# Altium schematic sheet Board-A_Schematics.SchDoc
size A3; SheetNumber: 1; SheetTotal: 1
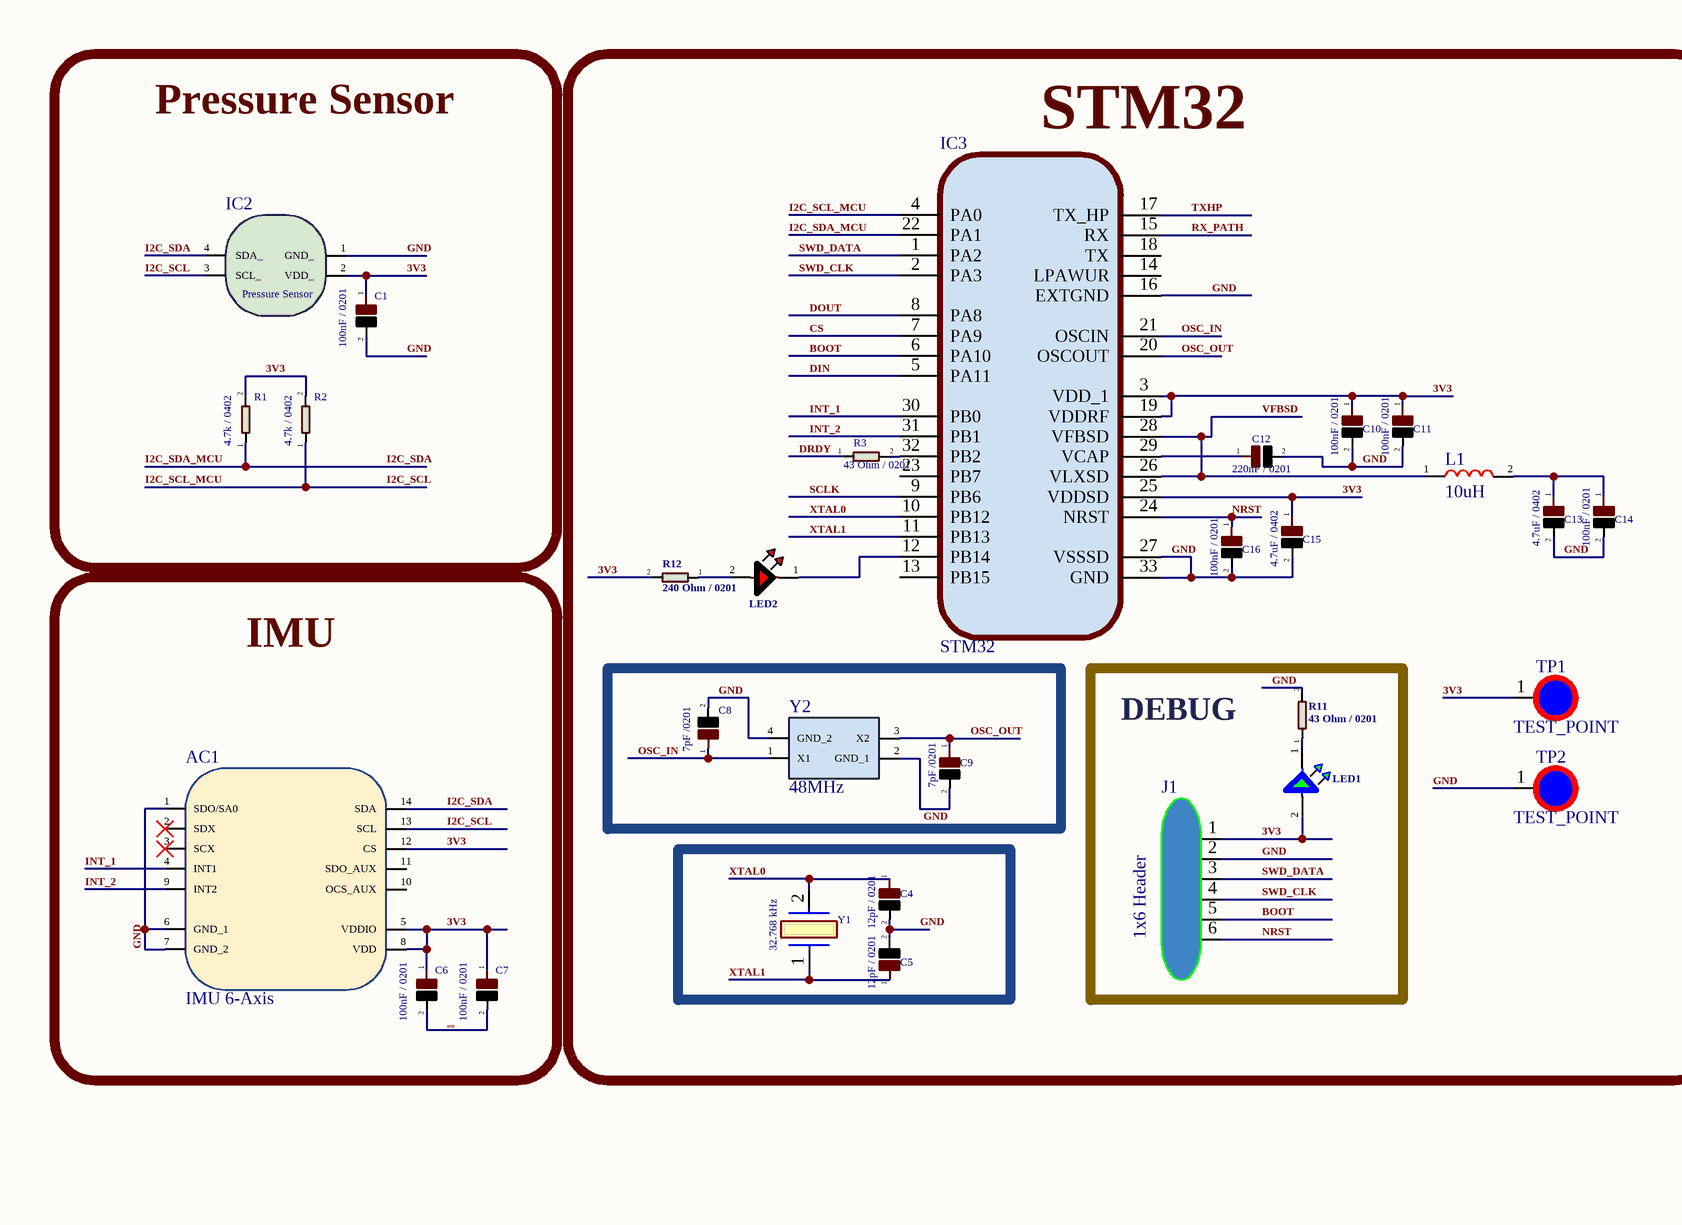
[diagram p0: Board-A_Schematics.SchDoc, left]
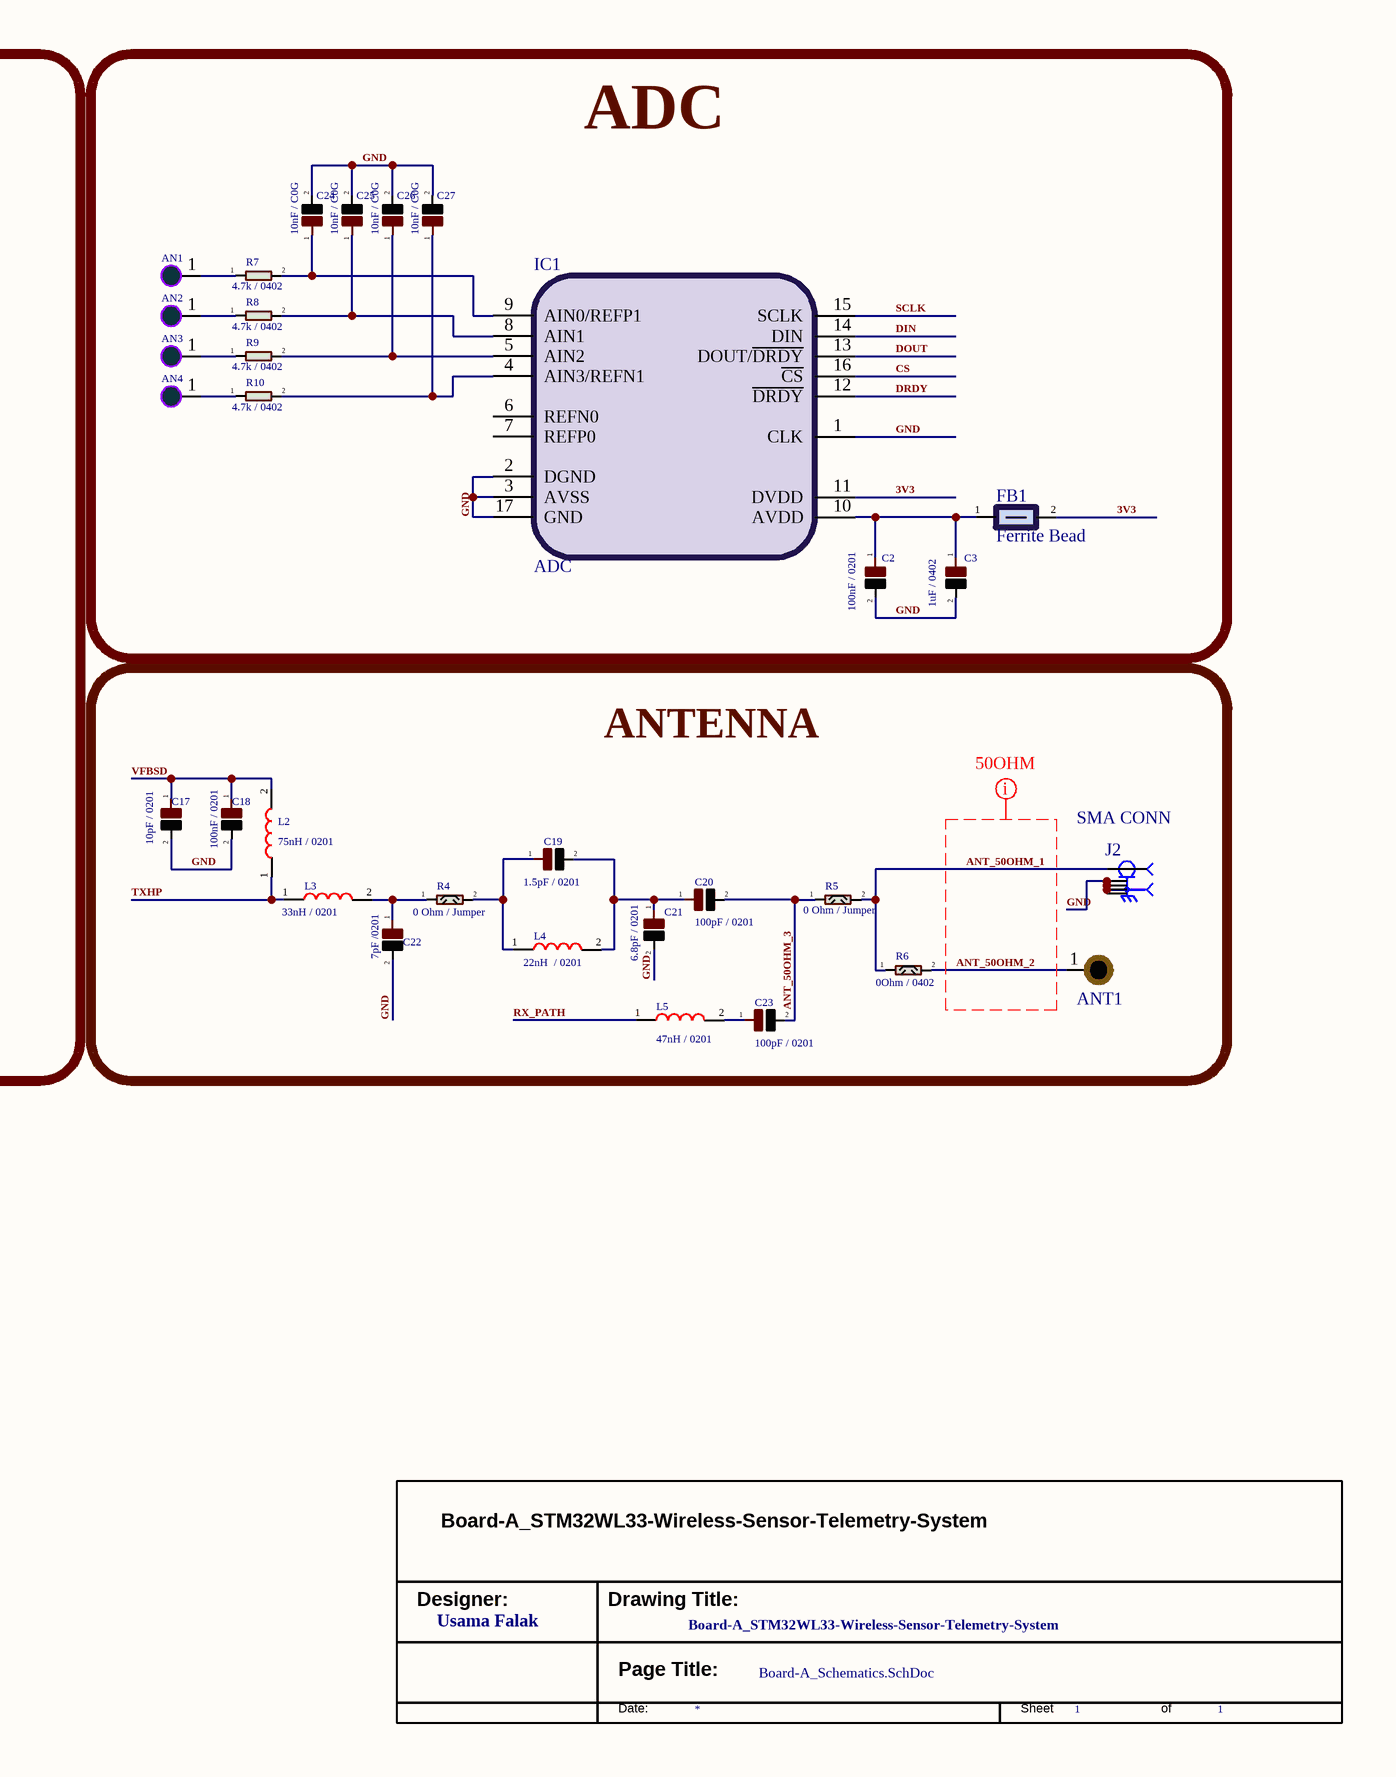
[diagram p1: Board-A_Schematics.SchDoc, right]

## Parts
*  TitleBlock_MCPG_a  (value not drawn)  (graphical)
AC1  IMU 6-Axis  [LSM6DS3USTR]
AN1  ADC_AIN  [Analogue Pad]  (value not drawn)
AN2  ADC_AIN  [Analogue Pad]  (value not drawn)
AN3  ADC_AIN  [Analogue Pad]  (value not drawn)
AN4  ADC_AIN  [Analogue Pad]  (value not drawn)
ANT1  PAD  [ANTENNA-PAD]  (value not drawn)
C1  100nF / 0201  [CAPC-C0201]
C2  100nF / 0201  [CAPC-C0201]
C3  1uF / 0402  [CAPC-C0402]
C4  12pF / 0201  [CAPC-C0201]
C5  12pF / 0201  [CAPC-C0201]
C6  100nF / 0201  [CAPC-C0201]
C7  100nF / 0201  [CAPC-C0201]
C8  7pF /0201  [CAPC-C0201]
C9  7pF /0201  [CAPC-C0201]
C10  100nF / 0201  [CAPC-C0201]
C11  100nF / 0201  [CAPC-C0201]
C12  220nF / 0201  [CAPC-C0201]
C13  4.7uF / 0402  [CAPC-C0402]
C14  100nF / 0201  [CAPC-C0201]
C15  4.7uF / 0402  [CAPC-C0402]
C16  100nF / 0201  [CAPC-C0201]
C17  10pF / 0201  [CAPC-C0201]
C18  100nF / 0201  [CAPC-C0201]
C19  1.5pF / 0201  [CAPC-C0201]
C20  100pF / 0201  [CAPC-C0201]
C21  6.8pF / 0201  [CAPC-C0201]
C22  7pF /0201  [CAPC-C0201]
C23  100pF / 0201  [CAPC-C0201]
C24  10nF / C0G  [CAPC-C0402]
C25  10nF / C0G  [CAPC-C0402]
C26  10nF / C0G  [CAPC-C0402]
C27  10nF / C0G  [CAPC-C0402]
FB1  Ferrite Bead  [BLM15PX_BH1]
IC1  ADC  [QFN50P350X350X100-17N-D]
IC2  Pressure Sensor  [MS584002BA01]
IC3  STM32  [QFN50P500X500X100-33N-D]
J1  1x6 Header  [GRPB032MWCNRC]
J2  SMA CONN  [SAMTEC_SMA-J-P-H-ST-EM1]
L1  10uH  [IND-C1608X95N]
L2  75nH / 0201  [INDC-C0201]
L3  33nH / 0201  [INDC-C0201]
L4  22nH  / 0201  [INDC-C0201]
L5  47nH / 0201  [IND-0201]
LED1  GREEN-LED  [LEDC-C0201]  (value not drawn)
LED2  RED-LED  [LEDC-C0201]  (value not drawn)
R1  4.7k / 0402  [RESC-C0402]
R2  4.7k / 0402  [RESC-C0402]
R3  43 Ohm / 0201  [RESC-C0201]
R4  0 Ohm / Jumper  [RESC-C0201]
R5  0 Ohm / Jumper  [RESC-C0201]
R6  0Ohm / 0402  [RESC-C0402]
R7  4.7k / 0402  [RESC-C0402]
R8  4.7k / 0402  [RESC-C0402]
R9  4.7k / 0402  [RESC-C0402]
R10  4.7k / 0402  [RESC-C0402]
R11  43 Ohm / 0201  [RESC-C0201]
R12  240 Ohm / 0201  [RESC-C0201]
TP1  TEST_POINT  [TEST-POINT]
TP2  TEST_POINT  [TEST-POINT]
Y1  32.768 kHz  [Q13FC1350000400]
Y2  48MHz  [ABM11W300000MHZ4B1UT3]

## Blocks framed on the sheet
Pressure Sensor: C1 IC2 R1 R2
STM32: C4 C5 C8-C16 IC3 L1 LED2 R3 R12 TP1 TP2 Y1 Y2
ADC: AN1-AN4 C2 C3 C24-C27 FB1 IC1 R7-R10
IMU: AC1 C6 C7
DEBUG: J1 LED1 R11
ANTENNA: ANT1 C17-C23 J2 L2-L5 R4-R6

## Nets
3V3: AC1.5(VDDIO) AC1.8(VDD) AC1.12(CS) C1.1 C6.1 C7.1 C10.1 C11.1 C15.1 FB1.2 IC1.11(DVDD) IC2.2(VDD_) IC3.3(VDD_1) IC3.19(VDDRF) IC3.25(VDDSD) J1.1 LED1.2(A) R1.2 R2.2 R12.2 TP1.1
ANT_50OHM_1: J2.1 R5.2 R6.1
ANT_50OHM_2: ANT1.1 R6.2
ANT_50OHM_3: C20.2 C23.2 R5.1
BOOT: IC3.6(PA10) J1.5
CS: IC1.16(~{CS}) IC3.7(PA9)
DIN: IC1.14(DIN) IC3.5(PA11)
DOUT: IC1.13(DOUT/~{DRDY}) IC3.8(PA8)
DRDY: IC1.12(~{DRDY}) R3.1
GND: AC1.1(SDO/SA0) AC1.6(GND_1) AC1.7(GND_2) C1.2 C2.2 C3.2 C4.2 C5.2 C6.2 C7.2 C8.2 C9.2 C10.2 C11.2 C12.2 C13.2 C14.2 C15.2 C16.2 C17.2 C18.2 C21.2 C22.2 C24.2 C25.2 C26.2 C27.2 IC1.1(CLK) IC1.2(DGND) IC1.3(AVSS) IC1.17(GND) IC2.1(GND_) IC3.16(EXTGND) IC3.27(VSSSD) IC3.33(GND) J1.2 J2.2_1 J2.2_2 J2.3_1 J2.3_2 R11.2 TP2.1 Y2.2(GND_1) Y2.4(GND_2)
I2C_SCL: AC1.13(SCL) IC2.3(SCL_) IC3.4(PA0) R2.1  [also labelled I2C_SCL_MCU]
I2C_SDA: AC1.14(SDA) IC2.4(SDA_) IC3.22(PA1) R1.1  [also labelled I2C_SDA_MCU]
INT_1: AC1.4(INT1) IC3.30(PB0)
INT_2: AC1.9(INT2) IC3.31(PB1)
NRST: C16.1 IC3.24(NRST) J1.6
OSC_IN: C8.1 IC3.21(OSCIN) Y2.1(X1)
OSC_OUT: C9.1 IC3.20(OSCOUT) Y2.3(X2)
RX_PATH: IC3.15(RX) L5.1
SCLK: IC1.15(SCLK) IC3.9(PB6)
SWD_CLK: IC3.2(PA3) J1.4
SWD_DATA: IC3.1(PA2) J1.3
TXHP: IC3.17(TX_HP) L2.1 L3.1
VFBSD: C17.1 C18.1 IC3.26(VLXSD) IC3.28(VFBSD) L1.1 L2.2
XTAL0: C4.1 IC3.10(PB12) Y1.2(CRYSTAL_2)
XTAL1: C5.1 IC3.11(PB13) Y1.1
NetAN1_1: AN1.1 R7.1
NetAN2_1: AN2.1 R8.1
NetAN3_1: AN3.1 R9.1
NetAN4_1: AN4.1 R10.1
NetC2_1: C2.1 C3.1 FB1.1 IC1.10(AVDD)
NetC12_1: C12.1 IC3.29(VCAP)
NetC13_1: C13.1 C14.1 L1.2
NetC19_1: C19.1 L4.1 R4.2
NetC19_2: C19.2 C20.1 C21.1 L4.2
NetC22_1: C22.1 L3.2 R4.1
NetC23_1: C23.1 L5.2
NetC24_1: C24.1 IC1.9(AIN0/REFP1) R7.2
NetC25_1: C25.1 IC1.8(AIN1) R8.2
NetC26_1: C26.1 IC1.5(AIN2) R9.2
NetC27_1: C27.1 IC1.4(AIN3/REFN1) R10.2
NetIC3_12: IC3.12(PB14) LED2.1(K)
NetIC3_32: IC3.32(PB2) R3.2
NetLED1_1: LED1.1(K) R11.1
NetLED2_2: LED2.2(A) R12.1

Not connected (* = marked no-connect by the designer): AC1 2(SDX)* 3(SCX)* 10(OCS_AUX) 11(SDO_AUX); IC1 6(REFN0) 7(REFP0); IC3 13(PB15) 14(LPAWUR) 18(TX) 23(PB7)

## Layout directives
net class 50OHM: ANT_50OHM_1, ANT_50OHM_2

## Notes on the sheet
- (in symbol TitleBlock_MCPG_a) Board-A_STM32WL33-Wireless-Sensor-Telemetry-System; Designer:; Drawing Title:; Usama Falak; Page Title:; Date:; Sheet; of

## Library data of the parts
AC1 = LSM6DSOTR: Accelerometer, Gyroscope, 6 Axis Sensor I2C, SPI Output; Manufacturer_Name: STMicroelectronics; Datasheet Link: https://www.st.com/resource/en/datasheet/lsm6dso.pdf; Height: 0.86mm; Manufacturer_Part_Number: LSM6DSOTR; Mouser Part Number: 511-LSM6DSOTR; Mouser Price/Stock: https://www.mouser.co.uk/ProductDetail/STMicroelectronics/LSM6DSOTR?qs=lc2O%252BfHJPVbD197C5c7oNw%3D%3D; Arrow Part Number: LSM6DSOTR; Arrow Price/Stock: https://www.arrow.com/en/products/lsm6dsotr/stmicroelectronics.html?utm_currency=USD&region=europe
AN1-AN4 = ADC_PAD
ANT1 = ANTENNA-PAD
C1 C2 C6 C7 C10 C11 C14 C16 C18 = GRM033Z71C104KE14J: Multilayer Ceramic Capacitors MLCC - SMD/SMT 0.1 uF 16 VDC 10% 0201 X7R; Manufacturer_Name: Murata Electronics; Datasheet Link: https://search.murata.co.jp/Ceramy/image/img/A01X/G101/ENG/GRM033Z71C104KE14-01A.pdf; Height: 0.33mm; Manufacturer_Part_Number: GRM033Z71C104KE14J; Mouser Part Number: 81-GRM033Z71C104KE4J; Mouser Price/Stock: https://www.mouser.co.uk/ProductDetail/Murata-Electronics/GRM033Z71C104KE14J?qs=lEfY3O89AqkOnRdov738ag%3D%3D; LCSC-Part#: C5755505
C3 = TMK105AC6105KV-F: 1uF ±10% 25V Ceramic Capacitor X6S 0402; Manufacturer_Name: TAIYO YUDEN; Datasheet Link: https://componentsearchengine.com/Datasheets/2/TMK105AC6105KV-F.pdf; Height: 0.6mm; Manufacturer_Part_Number: TMK105AC6105KV-F; Mouser Part Number: 963-TMK105AC6105KV-F; Mouser Price/Stock: https://www.mouser.co.uk/ProductDetail/Taiyo-Yuden/TMK105AC6105KV-F?qs=VWNNG7jHlrK4QAsTUyZliw%3D%3D; LCSC-Part#: C2169575
C4 C5 = GJM0335C1E120GB01D: 12pF ±2% 25V Ceramic Capacitor X6S 0201; Manufacturer_Name: Murata Electronics; Datasheet Link: https://search.murata.co.jp/Ceramy/image/img/A01X/G101/ENG/GJM0335C1E120GB01-31A.pdf; Height: 0.33mm; Manufacturer_Part_Number: GJM0335C1E120GB01D; Mouser Part Number: 81-GJM0335C1E120GB1D; Mouser Price/Stock: https://www.mouser.co.uk/ProductDetail/Murata-Electronics/GJM0335C1E120GB01D?qs=ui%252B2d9lVEI54IbZGcLUeEQ%3D%3D; Arrow Part Number: GJM0335C1E120GB01D; Arrow Price/Stock: https://www.arrow.com/en/products/gjm0335c1e120gb01d/murata-manufacturing?region=nac; LCSC-Part#: C710720
C8 C9 C22 = GJM0335C1E7R0BB01D: 7pF 25V Ceramic Capacitor C0G 0201; Manufacturer_Name: Murata Electronics; Datasheet Link: https://search.murata.co.jp/Ceramy/image/img/A01X/G101/ENG/GJM0335C1E7R0BB01-31A.pdf; Height: 0.33mm; Manufacturer_Part_Number: GJM0335C1E7R0BB01D; LCSC-Part#: C1864565
C12 = GRM033C81A224KE01D: 220nF X6S ±10% 10V 0201 Ceramic Capacitors RoHS; Manufacturer_Name: Murata Electronics; Datasheet Link: https://search.murata.co.jp/Ceramy/image/img/A01X/G101/ENG/GRM033C81A224KE01-01A.pdf; Height: 0.33mm; Manufacturer_Part_Number: GRM033C81A224KE01D; LCSC-Part#: C20044506
C13 C15 = GRM155C61E475ME15J: 4.7uF ±20% 25V Ceramic Capacitor 0402; Manufacturer_Name: Murata Electronics; Datasheet Link: https://search.murata.co.jp/Ceramy/image/img/A01X/G101/ENG/GRM155C61E475ME15-01A.pdf; Height: 0.33mm; Manufacturer_Part_Number: GRM155C61E475ME15J; Mouser Part Number: 81-GRM15C61E475ME15J; Mouser Price/Stock: https://www.mouser.co.uk/ProductDetail/Murata-Electronics/GRM155C61E475ME15J?qs=By6Nw2ByBD02p8xq06vhEQ%3D%3D; Arrow Part Number: GRM155C61E475ME15J; Arrow Price/Stock: https://www.arrow.com/en/products/grm155c61e475me15j/murata-manufacturing?utm_currency=USD&region=nac; LCSC-Part#: C5846150
C17 = GJM0335C1E100GB01D: 10pF ±2% 25V Ceramic Capacitor C0G 0201; Manufacturer_Name: Murata Electronics; Datasheet Link: https://search.murata.co.jp/Ceramy/image/img/A01X/G101/ENG/GJM0335C1E100GB01-31A.pdf; Height: 0.33mm; Manufacturer_Part_Number: GJM0335C1E100GB01D; Mouser Part Number: 81-GJM0335C1E100GB1D; Mouser Price/Stock: https://www.mouser.co.uk/ProductDetail/Murata-Electronics/GJM0335C1E100GB01D?qs=ui%252B2d9lVEI7JJM6SC54Bmg%3D%3D; LCSC-Part#: C237422
C19 = GJM0335C1E1R5WB01D: 1.5pF 25V Ceramic Capacitor C0G 0201; Manufacturer_Name: Murata Electronics; Datasheet Link: https://search.murata.co.jp/Ceramy/image/img/A01X/G101/ENG/GJM0335C1E1R5WB01-01A.pdf; Height: 0.33mm; Manufacturer_Part_Number: GJM0335C1E1R5WB01D; Mouser Part Number: 81-GJM0335C1E1R5WB1D; Mouser Price/Stock: https://www.mouser.co.uk/ProductDetail/Murata-Electronics/GJM0335C1E1R5WB01D?qs=YLLXL5qGyDs1VzYPuYV7Xw%3D%3D; Arrow Part Number: GJM0335C1E1R5WB01D; Arrow Price/Stock: https://www.arrow.com/en/products/gjm0335c1e1r5wb01d/murata-manufacturing?utm_currency=USD&region=nac; LCSC-Part#: C435397
C20 C23 = GRM0335C1E101FA01D: Multilayer Ceramic Capacitors MLCC - SMD/SMT 100 pF 25 VDC 1% 0201 C0G (NP0); Manufacturer_Name: Murata Electronics; Datasheet Link: https://search.murata.co.jp/Ceramy/image/img/A01X/G101/ENG/GRM0335C1E101FA01-01A.pdf; Height: 0.33mm; Manufacturer_Part_Number: GRM0335C1E101FA01D; Mouser Part Number: 81-GRM0335C1E101FA1D; Mouser Price/Stock: https://www.mouser.co.uk/ProductDetail/Murata-Electronics/GRM0335C1E101FA01D?qs=3ZwS9AhGA%2F51pgyoCpOmmA%3D%3D; Arrow Part Number: GRM0335C1E101FA01D; Arrow Price/Stock: https://www.arrow.com/en/products/grm0335c1e101fa01d/murata-manufacturing; LCSC-Part#: C527989
C21 = GJM0335C1E6R8CB01D: Multilayer Ceramic Capacitors MLCC - SMD/SMT 6.8 pF 25 VDC 0.25 pF 0201 C0G (NP0); Manufacturer_Name: Murata Electronics; Datasheet Link: https://search.murata.co.jp/Ceramy/image/img/A01X/G101/ENG/GJM0335C1E6R8CB01-01A.pdf; Height: 0.33mm; Manufacturer_Part_Number: GJM0335C1E6R8CB01D; LCSC-Part#: C415404
C24-C27 = GRM1555C1E103GE01D: 10nF ±2% 25V Ceramic Capacitor C0G 0402; Manufacturer_Name: Murata Electronics; Datasheet Link: https://search.murata.co.jp/Ceramy/image/img/A01X/G101/ENG/GRM1555C1E103GE01-01A.pdf; Height: 0.33mm; Manufacturer_Part_Number: GRM1555C1E103GE01D; Mouser Part Number: 81-GRM1555C1E103GE1D; Mouser Price/Stock: https://www.mouser.co.uk/ProductDetail/Murata-Electronics/GRM1555C1E103GE01D?qs=d0WKAl%252BL4KYoPP5%252BcWf4LA%3D%3D; Arrow Part Number: GRM1555C1E103GE01D; Arrow Price/Stock: https://www.arrow.com/en/products/grm1555c1e103ge01d/murata-manufacturing?region=europe; LCSC-Part#: C3872300
FB1 = BLM15PX601SH1D: 600Ω@100MHz Ferrite Bead 0402 900mA 230mΩ; Manufacturer_Name: Murata Electronics; Datasheet Link: https://www.murata.com/en-global/products/productdetail.aspx?cate=luNoiseSupprFilteChipFerriBead&partno=BLM15PX601SH1%23; Manufacturer_Part_Number: BLM15PX601SH1D; Mouser Part Number: 81-BLM15PX601SH1D; Mouser Price/Stock: https://www.mouser.co.uk/ProductDetail/Murata-Electronics/BLM15PX601SH1D?qs=9vOqFld9vZUw2N2VCY80IQ%3D%3D; Arrow Part Number: BLM15PX601SH1D; Arrow Price/Stock: https://www.arrow.com/en/products/blm15px601sh1d/murata-manufacturing?utm_currency=USD&region=nac; LCSC-Part#: C7509833
IC1 = ADS1220IRVAR: 24 Bit Analog to Digital Converter 2, 4 Input 1 Sigma-Delta 16-VQFN (3.5x3.5); Manufacturer_Name: Texas Instruments; Datasheet Link: http://www.ti.com/lit/ds/symlink/ads1220.pdf; Height: 1mm; Manufacturer_Part_Number: ADS1220IRVAR; Mouser Part Number: 595-ADS1220IRVAR; Mouser Price/Stock: https://www.mouser.co.uk/ProductDetail/Texas-Instruments/ADS1220IRVAR?qs=5GI1giJCN%252BLdhhbryxXlqQ%3D%3D; Arrow Part Number: ADS1220IRVAR; Arrow Price/Stock: https://www.arrow.com/en/products/ads1220irvar/texas-instruments?utm_currency=USD&region=nac
IC2 = MS5840-02BA01: Pressure Sensor 4.35PSI ~ 17.4PSI (30kPa ~ 120kPa) Absolute 24 b 4-SMD, No Lead; Manufacturer_Name: TE Connectivity; Height: 1.7mm; Manufacturer_Part_Number: MS5840-02BA01; Mouser Part Number: 824-MS5840-02BA01; Mouser Price/Stock: https://www.mouser.co.uk/ProductDetail/Measurement-Specialties/MS5840-02BA01?qs=gZXFycFWdAN7%252BD1H1Y3uGA%3D%3D
IC3 = STM32WL33KBV7: ARM Microcontrollers - MCU Sub-GHz Wireless MCU Single-core Arm Cortex-M0+ 64 MHz 128 Kb Flash 32 Kb SRAM; Manufacturer_Name: STMicroelectronics; Datasheet Link: https://www.st.com/resource/en/datasheet/stm32wl33c8.pdf; Height: 1mm; Manufacturer_Part_Number: STM32WL33KBV7; Arrow Part Number: STM32WL33KBV7; Arrow Price/Stock: https://www.arrow.com/en/products/stm32wl33kbv7/stmicroelectronics.html?utm_currency=USD&region=nac
J1 = GRPB032MWCN-RC: Connector; Manufacturer_Name: Sullins; Datasheet Link: https://s3.amazonaws.com/catalogspreads-pdf/PAGE94-95%20.050%20MALE%20HDR%20ST%20RA%20SMT.pdf; Height: 3.4mm; Manufacturer_Part_Number: GRPB032MWCN-RC
J2 = SMA-J-P-H-ST-EM1: MF: Samtec; Package: None; Price: None; Value: *; MP: SMA-J-P-H-ST-EM1; Availability: Unavailable
L1 = MLZ1608M100WTD25: 10uH 1.05Ω Standard AEC-Q200; Manufacturer_Name: TDK; Datasheet Link: https://product.tdk.com/system/files/dam/doc/product/inductor/inductor/smd/catalog/inductor_automotive_decoupling_mlz1608_en.pdf; Height: 0.95mm; Manufacturer_Part_Number: MLZ1608M100WTD25; Mouser Part Number: 810-MLZ1608M100WTD25; Mouser Price/Stock: https://www.mouser.co.uk/ProductDetail/TDK/MLZ1608M100WTD25?qs=u4%252BEJ9urDATpNhOvJ54DAQ%3D%3D; Arrow Part Number: MLZ1608M100WTD25; Arrow Price/Stock: https://www.arrow.com/en/products/mlz1608m100wtd25/tdk?utm_currency=USD&region=europe; LCSC-Part#: C2047264
L2 = LQP03TN75NJ02D: 100mA 75nH ±5% 10Ω 0201 Fixed Inductors RoHS; Manufacturer_Name: Murata Electronics; Datasheet Link: https://search.murata.co.jp/Ceramy/image/img/P02/JELF243C-0015.pdf; Height: 0.33mm; Manufacturer_Part_Number: LQP03TN75NJ02D; Mouser Part Number: 81-LQP03TN75NJ02D; Mouser Price/Stock: https://www.mouser.com/Search/Refine.aspx?Keyword=81-LQP03TN75NJ02D; LCSC-Part#: C913516
L3 = LQP03TG33NJ02D: 110mA 33nH ±5% 4.25Ω 0201 Fixed Inductors RoHS; Manufacturer_Name: Murata Electronics; Datasheet Link: https://search.murata.co.jp/Ceramy/image/img/P02/JELF243C-0016.pdf; Height: 0.33mm; Manufacturer_Part_Number: LQP03TG33NJ02D; Mouser Part Number: 81-LQP03TG33NJ02D; Mouser Price/Stock: https://www.mouser.com/Search/Refine.aspx?Keyword=81-LQP03TG33NJ02D; LCSC-Part#: C337948
L4 = LQP03TG22NJ02D: 140mA 22nH ±5% 2.85Ω Thick Film Inductor 0201 Fixed Inductors RoHS; Manufacturer_Name: Murata Electronics; Datasheet Link: https://search.murata.co.jp/Ceramy/image/img/P02/JELF243C-0016.pdf; Height: 0.33mm; Manufacturer_Part_Number: LQP03TG22NJ02D; Mouser Part Number: 81-LQP03TG22NJ02D; Mouser Price/Stock: https://www.mouser.co.uk/ProductDetail/Murata-Electronics/LQP03TG22NJ02D?qs=%252BAZVS4b%2FkgKn6NoYx0zfhQ%3D%3D; LCSC-Part#: C237576
L5 = LQP03HQ47NH02D: Inductor; Manufacturer_Name: Murata Electronics; Datasheet Link: https://search.murata.co.jp/Ceramy/image/img/P02/JELF243C-0021.pdf; Height: 0.42mm; Manufacturer_Part_Number: LQP03HQ47NH02D; Mouser Part Number: 81-LQP03HQ47NH02D; Mouser Price/Stock: https://www.mouser.co.uk/ProductDetail/Murata-Electronics/LQP03HQ47NH02D?qs=B6kkDfuK7%2FDPvY4SgbF1QA%3D%3D
LED1 = XL-0201UGC: Emerald Green 525nm LED Indication - Discrete 3.3V 0201; Manufacturer_Name: XINGLIGHT; Datasheet Link: http://www.xinglight.cn/uploadfile/202403/c390b9cc98e0bd5.pdf; Height: 0.65mm; Manufacturer_Part_Number: XL-0201UGC
LED2 = XL-0201SURC: Red LED Indication - Discrete 0201; Manufacturer_Name: XINGLIGHT; Datasheet Link: http://www.xinglight.cn/uploadfile/202403/a9b8d0ab9895e7d.pdf; Height: 0.65mm; Manufacturer_Part_Number: XL-0201SURC; LCSC-Part#: C3646923; LCSC-Part: C3646923
R1 R2 R7-R10 = RT0402BRD074K7L: 62.5mW 4.7kΩ 50V Thin Film Resistor ±25ppm/℃ ±0.1% 0402 Chip Resistor - Surface Mount RoHS; Manufacturer_Name: Yageo Group; Datasheet Link: https://www.yageo.com/upload/media/product/productsearch/datasheet/rchip/PYu-RT_1-to-0.01_RoHS_L_12.pdf; Height: 0.35mm; Manufacturer_Part_Number: RT0402BRD074K7L; Mouser Part Number: 603-RT0402BRD074K7L; Mouser Price/Stock: https://www.mouser.com/Search/Refine.aspx?Keyword=603-RT0402BRD074K7L; Arrow Part Number: RT0402BRD074K7L; Arrow Price/Stock: https://www.arrow.com/en/products/rt0402brd074k7l/yageo; LCSC-Part#: C281778
R3 R11 = AC0201FR-0743RL: 43Ω ±1% 50mW 0201 Thick Film; LCSC-Part#: C226550
R4 R5 = CRCW02010000Z0ED: Resistor; Manufacturer_Name: Vishay; Datasheet Link: http://www.vishay.com/docs/20035/dcrcwe3.pdf; Height: 0.28mm; Manufacturer_Part_Number: CRCW02010000Z0ED; Mouser Part Number: 71-CRCW02010000Z0ED; Mouser Price/Stock: https://www.mouser.co.uk/ProductDetail/Vishay-Dale/CRCW02010000Z0ED?qs=IQLUlsvFoXvEDlw%2FRr8tQg%3D%3D; Arrow Part Number: CRCW02010000Z0ED; Arrow Price/Stock: https://www.arrow.com/en/products/crcw02010000z0ed/vishay?utm_currency=USD&region=nac; LCSC-Part#: C844709
R6 = ERJ-2GE0R00X: 0 Ohms Jumper Chip Resistor 0402 (1005 Metric) Automotive AEC-Q200 Thick Film; Manufacturer_Name: Panasonic; Datasheet Link: http://industrial.panasonic.com/www-cgi/jvcr13pz.cgi?E+PZ+3+AOA0001+ERJ2GE0R00X+7+WW; Height: 0.4mm; Manufacturer_Part_Number: ERJ-2GE0R00X; Mouser Part Number: 667-ERJ-2GE0R00X; Mouser Price/Stock: https://www.mouser.co.uk/ProductDetail/Panasonic/ERJ-2GE0R00X?qs=Cz%252B5TvT4yly5%252BP7oLZcLxw%3D%3D; Arrow Part Number: ERJ-2GE0R00X; Arrow Price/Stock: https://www.arrow.com/en/products/erj2ge0r00x/panasonic?utm_currency=USD&region=nac; LCSC-Part#: C242160
R12 = AC0201FR-07240RL: 50mW 240Ω 25V Thick Film Resistor ±1% ±200ppm/℃ 0201 Chip Resistor - Surface Mount RoHS; LCSC-Part#: C226476
Y1 = Q13FC1350000400: 32.768 kHz ±20ppm Crystal 12.5pF 70 kOhms 2-SMD, No Lead; Manufacturer_Name: Seiko Epson Corporation; Datasheet Link: https://datasheet.lcsc.com/szlcsc/1901081604_Seiko-Epson-Q13FC1350000400_C32346.pdf; Height: 0.9mm; Manufacturer_Part_Number: Q13FC1350000400; LCSC-Part#: C32346
Y2 = ABM11W-48.0000MHZ-7-B1U-T3: Crystal 48MHz ±10ppm 7pF 40Ω SMD2016-4P; Manufacturer_Name: ABRACON; Datasheet Link: https://abracon.com/Resonators/ABM11W.pdf; Height: 0.5mm; Manufacturer_Part_Number: ABM11W-48.0000MHZ-7-B1U-T3; Mouser Part Number: 815-11W48-7B1UT; Mouser Price/Stock: https://www.mouser.co.uk/ProductDetail/ABRACON/ABM11W-48.0000MHZ-7-B1U-T3?qs=5aG0NVq1C4zV3jiDtn%252BcSw%3D%3D; Arrow Part Number: ABM11W-48.0000MHZ-7-B1U-T3; Arrow Price/Stock: https://www.arrow.com/en/products/abm11w-48.0000mhz-7-b1u-t3/abracon?region=nac
* = TitleBlock_MCPG_a: Page Create Date: March  8, 1995